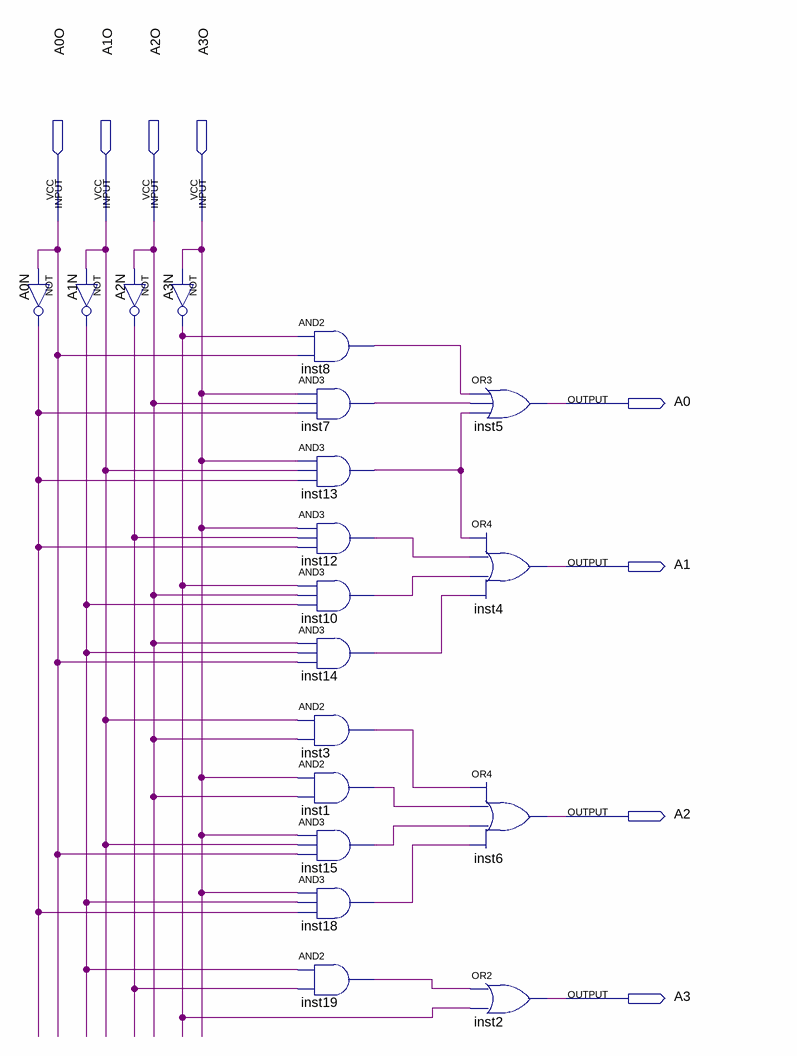
[diagram p0: schematic sheet]
// Quartus schematic Karnaugh.bdf as structural Verilog: 19 symbols, 8 pins
module Karnaugh (
  input  A0O,
  input  A1O,
  input  A2O,
  input  A3O,
  output A0,
  output A1,
  output A2,
  output A3
);

  wire A0N_out, A1N_out, A2N_out, A3N_out, inst1_out, inst3_out, inst7_out, inst8_out, inst10_out,
       inst12_out, inst13_out, inst14_out, inst15_out, inst18_out, inst19_out;

  not A0N (A0N_out, A0O);
  not A1N (A1N_out, A1O);
  not A2N (A2N_out, A2O);
  not A3N (A3N_out, A3O);
  and inst8 (inst8_out, A3N_out, A0O);
  and inst7 (inst7_out, A3O, A2O, A0N_out);
  and inst13 (inst13_out, A3O, A1O, A0N_out);
  and inst12 (inst12_out, A3O, A2N_out, A0N_out);
  and inst10 (inst10_out, A3N_out, A2O, A1N_out);
  and inst14 (inst14_out, A2O, A1N_out, A0O);
  and inst3 (inst3_out, A1O, A2O);
  and inst1 (inst1_out, A3O, A2O);
  and inst15 (inst15_out, A3O, A1O, A0O);
  and inst18 (inst18_out, A3O, A1N_out, A0N_out);
  and inst19 (inst19_out, A1N_out, A2N_out);
  or inst5 (A0, inst8_out, inst7_out, inst13_out);
  or inst4 (A1, inst13_out, inst12_out, inst10_out, inst14_out);
  or inst6 (A2, inst3_out, inst1_out, inst15_out, inst18_out);
  or inst2 (A3, inst19_out, A3N_out);
endmodule
